# EAGLE schematic gpslogger (EAGLE 6.5.0)
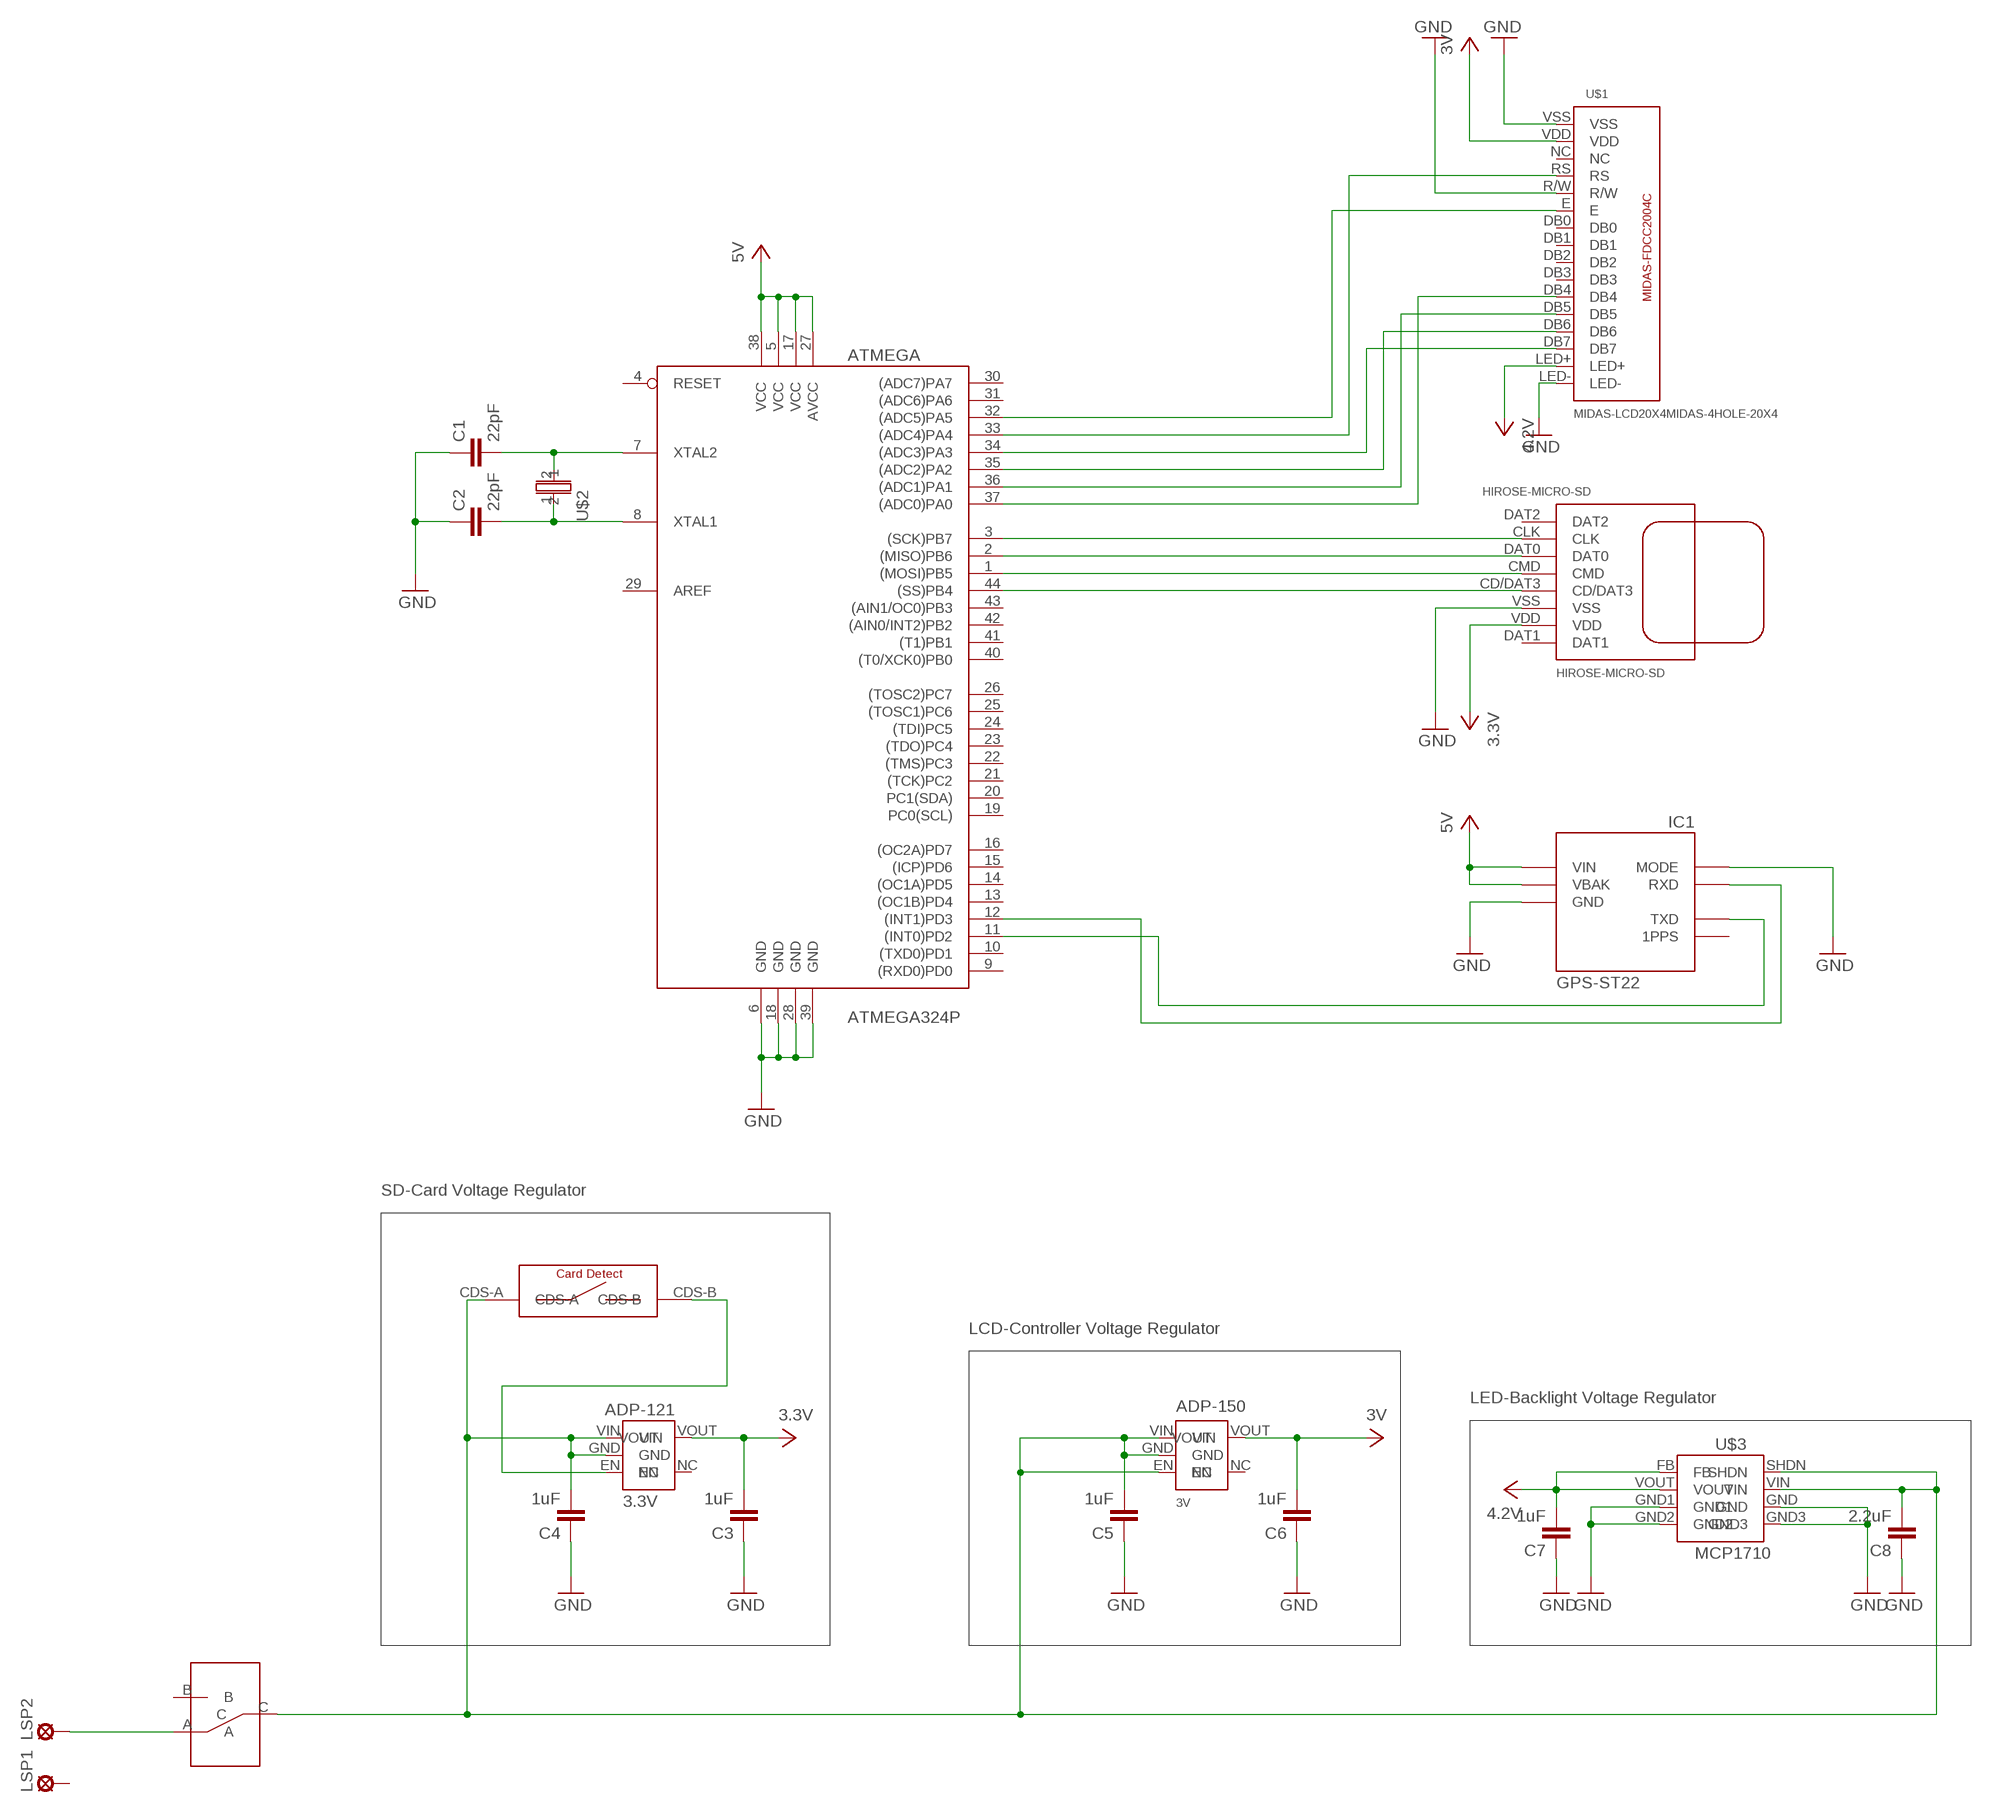
[diagram p0: schematic, sheet 1]

## Parts
ADP-121  3.3V  ADP121  [SOT23-5L]
ADP-150  3V  ADP150  [SOT23-5L]
ATMEGA  ATMEGA324P  [TQFP-44]
C1  22pF  C-EUC0201  [C0201]
C2  22pF  C-EUC0201  [C0201]
C3  1uF  C-EUC0201  [C0201]
C4  1uF  C-EUC0201  [C0201]
C5  1uF  C-EUC0201  [C0201]
C6  1uF  C-EUC0201  [C0201]
C7  1uF  C-EUC0201  [C0201]
C8  2.2uF  C-EUC0201  [C0201]
HIROSE-  HIROSE-MICRO-SD  [HIROSE-MICROSD-V2]
IC1  GPS-ST22  [GPS-ST22]
LSP1  LSP11  [LSP11]
LSP2  LSP11  [LSP11]
SWITCH  SLIDE-SWITCH  [ESP30XX]
U$1  MIDAS-LCD20X4MIDAS-4HOLE-20X4  [LCD-20X4]
U$2  49USMX  [HC49-4H]
U$3  MCP1710  [DFN-2X2]

## Nets
GND: ATMEGA.6(GND) ATMEGA.18(GND) ATMEGA.28(GND) ATMEGA.39(GND) C1.1 C2.1 C3.1 C4.1 C5.1 C6.1 C7.1 C8.1 HIROSE-.VSS(MICRO-SD:VSS) IC1.GND IC1.MODE U$1.LED- U$1.R/W U$1.VSS U$3.GND1 U$3.GND2
N$1: ATMEGA.3((SCK)PB7) HIROSE-.CLK(MICRO-SD:CLK)
N$2: ATMEGA.8(XTAL1) C2.2
N$3: ATMEGA.7(XTAL2) C1.2
N$4: ATMEGA.2((MISO)PB6) HIROSE-.DAT0(MICRO-SD:DAT0)
N$5: ATMEGA.1((MOSI)PB5) HIROSE-.CMD(MICRO-SD:CMD)
N$6: ATMEGA.44((SS)PB4) HIROSE-.CD/DAT3(MICRO-SD:CD/DAT3)
N$7: LSP2.MP SWITCH.A
N$8: ATMEGA.12((INT1)PD3) IC1.RXD
N$9: ADP-121.EN HIROSE-.CDS-B(CD:CDS-B)
N$10: ADP-121.VOUT C3.2 ; supply symbol labelled 3.3V
N$11: ATMEGA.11((INT0)PD2) IC1.TXD
N$12: ADP-121.GND ADP-121.VIN ADP-150.EN ADP-150.GND ADP-150.VIN C4.2 C5.2 C8.2 HIROSE-.CDS-A(CD:CDS-A) SWITCH.C U$3.SHDN U$3.VIN
N$13: ATMEGA.37((ADC0)PA0) U$1.DB4
N$14: ATMEGA.36((ADC1)PA1) U$1.DB5
N$15: ATMEGA.35((ADC2)PA2) U$1.DB6
N$16: ATMEGA.34((ADC3)PA3) U$1.DB7
N$17: ATMEGA.33((ADC4)PA4) U$1.RS
N$18: ATMEGA.32((ADC5)PA5) U$1.E
N$21: U$3.GND U$3.GND3 ; supply symbol labelled GND
N$23: U$1.LED+ ; supply symbol labelled 4.2V
VCC: ADP-150.VOUT ATMEGA.5(VCC) ATMEGA.17(VCC) ATMEGA.27(AVCC) ATMEGA.38(VCC) C6.2 C7.2 HIROSE-.VDD(MICRO-SD:VDD) IC1.VBAK IC1.VIN U$1.VDD U$3.FB U$3.VOUT ; supply symbol labelled 3.3V, 5V, 3V, 4.2V
Unconnected: ADP-121.NC ADP-150.NC ATMEGA.4(RESET) ATMEGA.9((RXD0)PD0) ATMEGA.10((TXD0)PD1) ATMEGA.13((OC1B)PD4) ATMEGA.14((OC1A)PD5) ATMEGA.15((ICP)PD6) ATMEGA.16((OC2A)PD7) ATMEGA.19(PC0(SCL)) ATMEGA.20(PC1(SDA)) ATMEGA.21((TCK)PC2) ATMEGA.22((TMS)PC3) ATMEGA.23((TDO)PC4) ATMEGA.24((TDI)PC5) ATMEGA.25((TOSC1)PC6) ATMEGA.26((TOSC2)PC7) ATMEGA.30((ADC7)PA7) ATMEGA.31((ADC6)PA6) ATMEGA.40((T0/XCK0)PB0) ATMEGA.41((T1)PB1) ATMEGA.42((AIN0/INT2)PB2) ATMEGA.43((AIN1/OC0)PB3) HIROSE-.DAT1(MICRO-SD:DAT1) HIROSE-.DAT2(MICRO-SD:DAT2) IC1.1PPS LSP1.MP SWITCH.B U$1.DB0 U$1.DB1 U$1.DB2 U$1.DB3 U$1.NC U$2.1 U$2.2

## Notes on the sheet
- SD-Card Voltage Regulator
- LCD-Controller Voltage Regulator
- LED-Backlight Voltage Regulator

## Power pins joined to a net without a drawn wire
AREF: ATMEGA.29(AREF)

## Library data of the parts
ADP-121 = adp150:ADP121
ADP-150 = adp150:ADP150
ATMEGA = ATMega324P:ATMEGA324P
C1-C8 = rcl:C-EU: CAPACITOR, European symbol
HIROSE- = hirosemicrosd:HIROSE-MICRO-SD
IC1 = gps:GPS-ST22
LSP1 LSP2 = solpad:LSP11: SOLDER PAD drill 1.1 mm
SWITCH = switch:SLIDE-SWITCH
U$1 = MIDAS-FDCC2004C:MIDAS-LCD20X4
U$2 = euroquartz-hc49:49USMX
U$3 = MCP1710T:MCP1710